# Altium schematic sheet WF_AutoCar.SchDoc
size A2
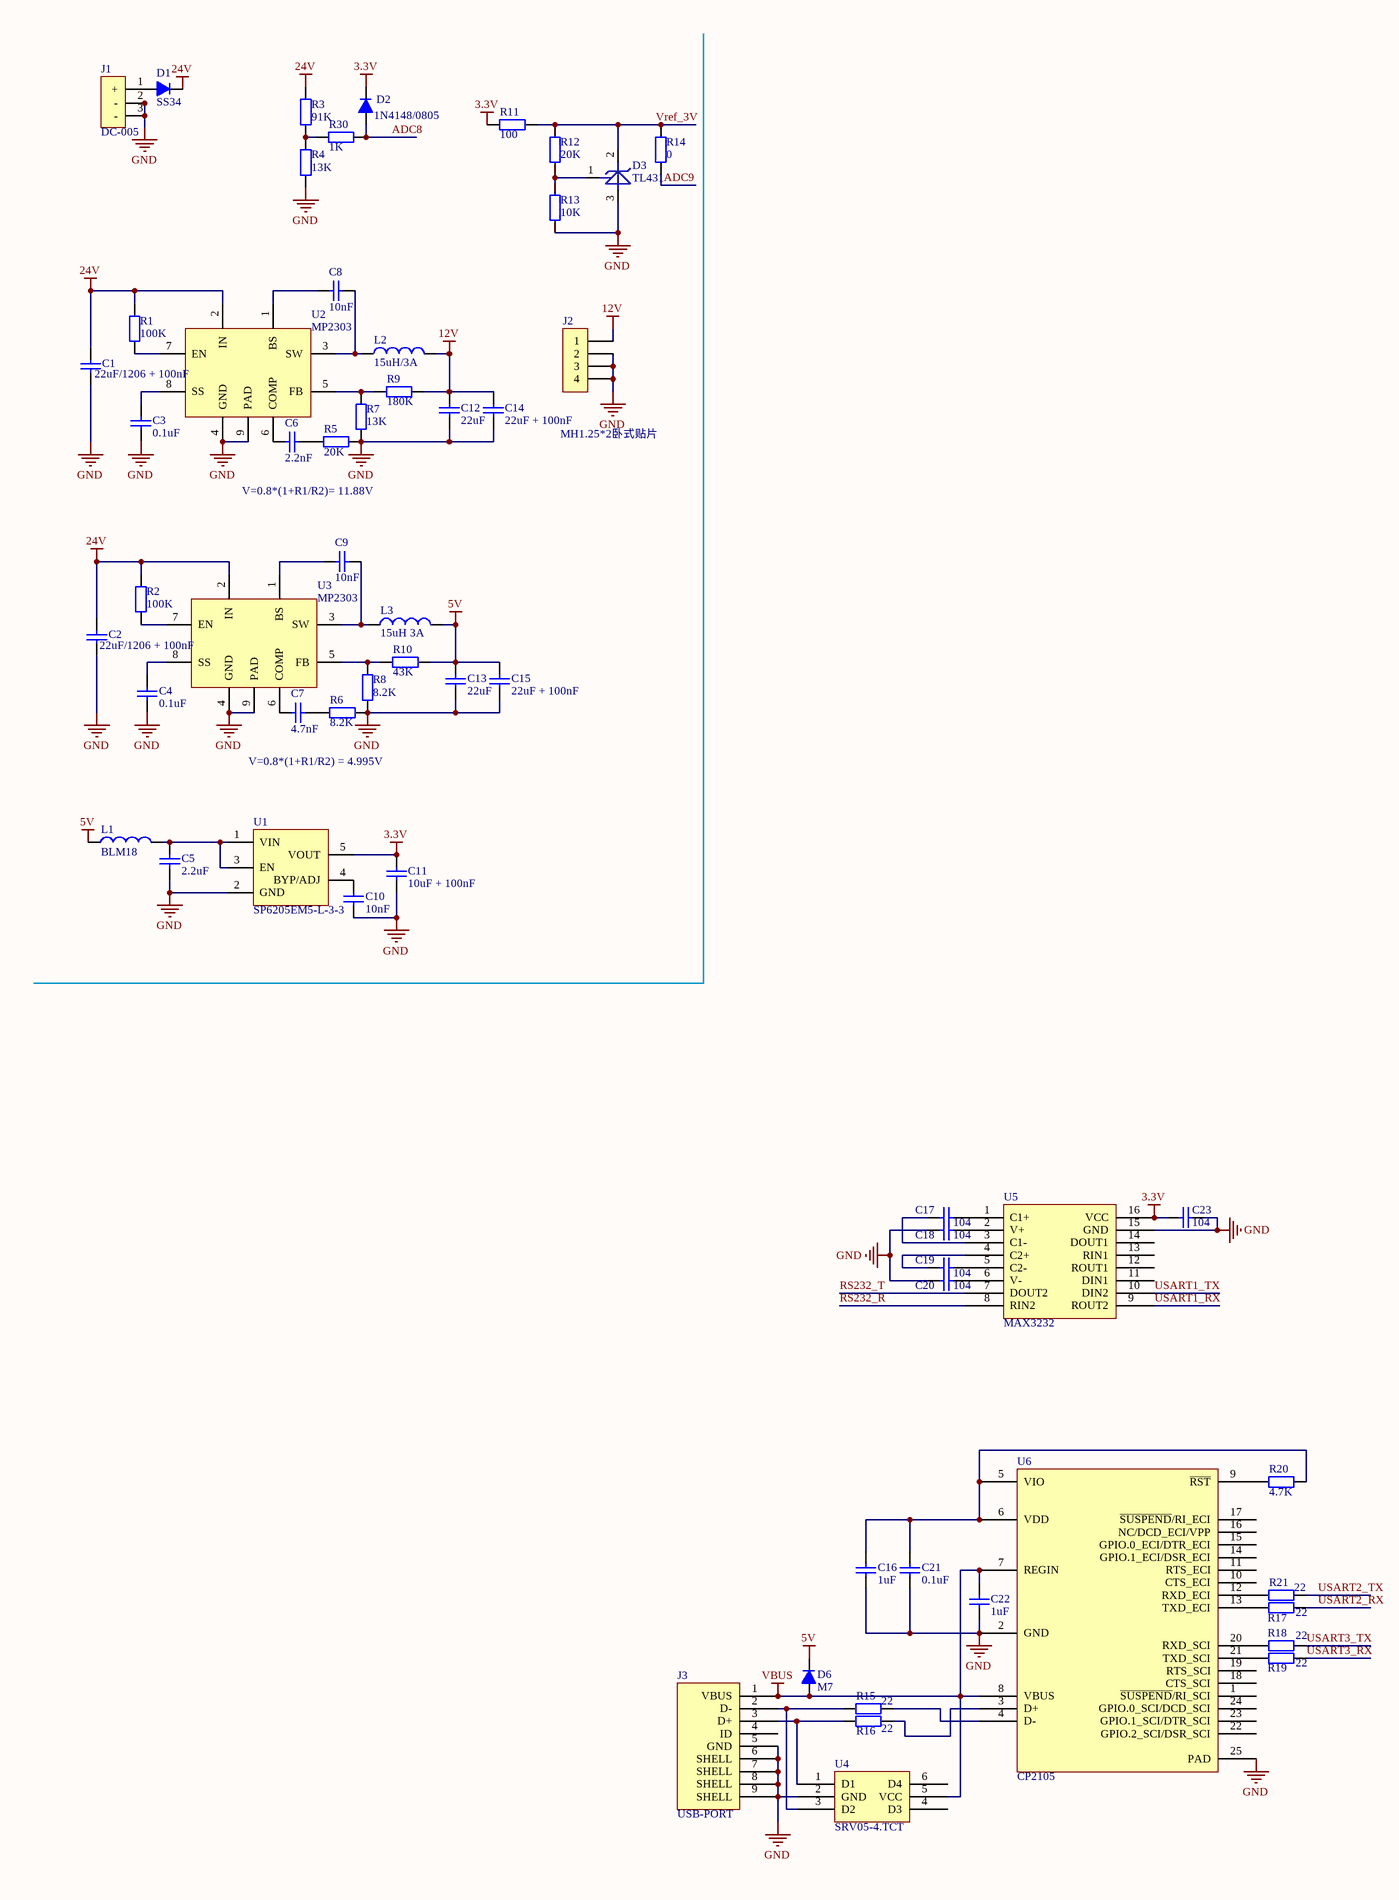
[diagram p0: WF_AutoCar.SchDoc, left]
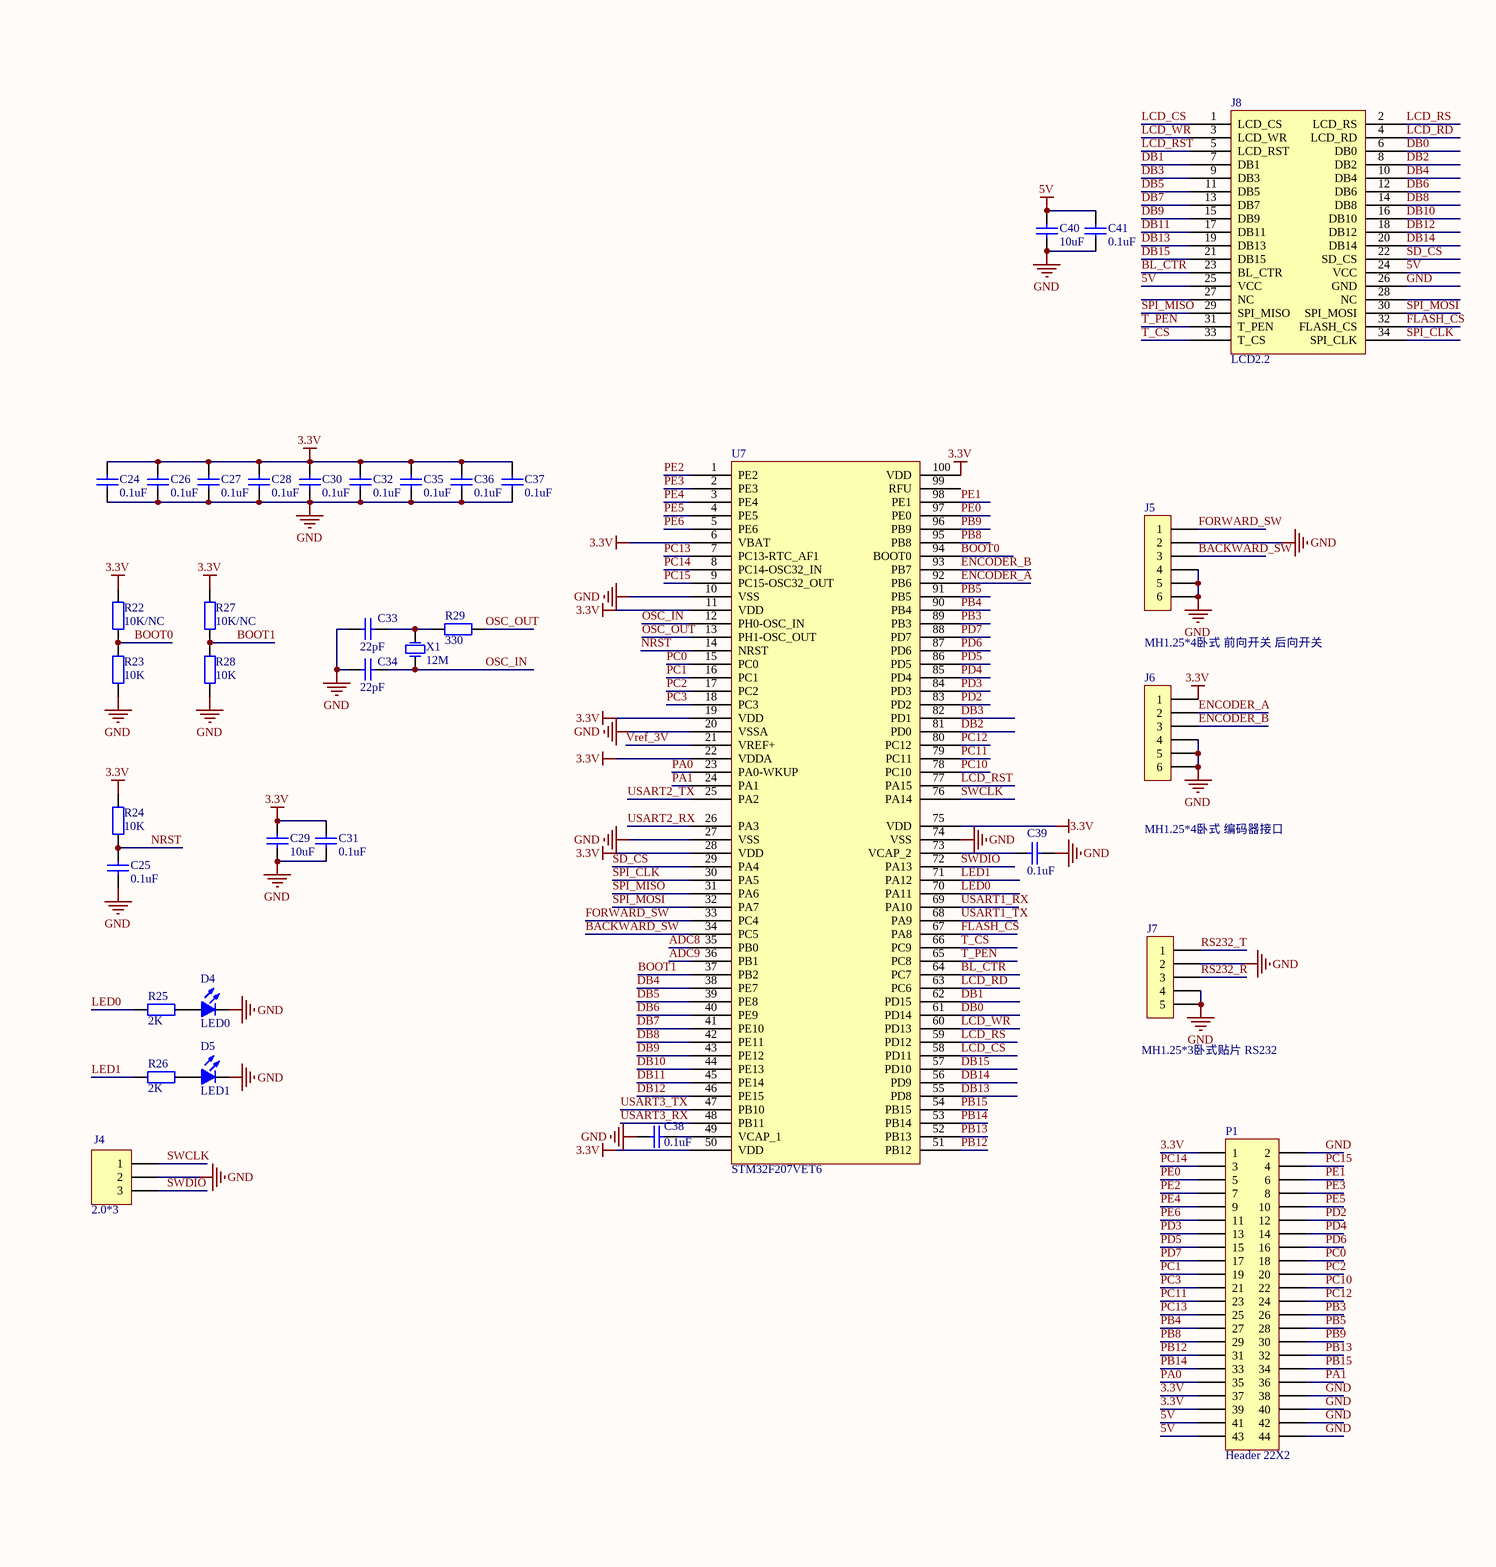
[diagram p1: WF_AutoCar.SchDoc, right]

## Parts
C1  value 22uF/1206 + 100nF  [C1206]  (hidden comment: Cap1)
C2  value 22uF/1206 + 100nF  [C1206]  (hidden comment: Cap1)
C3  value 0.1uF  [C0402]  (hidden comment: Cap1)
C4  value 0.1uF  [C0402]  (hidden comment: Cap1)
C5  value 2.2uF  [CC0805]  (hidden comment: Cap1)
C6  value 2.2nF  [C0402]  (hidden comment: Cap1)
C7  value 4.7nF  [C0402]  (hidden comment: Cap1)
C8  value 10nF  [C0402]  (hidden comment: Cap1)
C9  value 10nF  [C0402]  (hidden comment: Cap1)
C10  value 10nF  [C0402]  (hidden comment: Cap1)
C11  value 10uF + 100nF  [CC0805]  (hidden comment: Cap1)
C12  value 22uF  [CC0805]  (hidden comment: Cap1)
C13  value 22uF  [CC0805]  (hidden comment: Cap1)
C14  value 22uF + 100nF  [CC0805]  (hidden comment: Cap1)
C15  value 22uF + 100nF  [CC0805]  (hidden comment: Cap1)
C16  value 1uF  [C0402]  (hidden comment: Cap1)
C17  value 104  [C0402]  (hidden comment: Cap1)
C18  value 104  [C0402]  (hidden comment: Cap1)
C19  value 104  [C0402]  (hidden comment: Cap1)
C20  value 104  [C0402]  (hidden comment: Cap1)
C21  value 0.1uF  [C0402]  (hidden comment: Cap1)
C22  value 1uF  [C0402]  (hidden comment: Cap1)
C23  value 104  [C0402]  (hidden comment: Cap1)
C24  value 0.1uF  [C0402]  (hidden comment: Cap1)
C25  value 0.1uF  [C0402]  (hidden comment: Cap1)
C26  value 0.1uF  [C0402]  (hidden comment: Cap1)
C27  value 0.1uF  [C0402]  (hidden comment: Cap1)
C28  value 0.1uF  [C0402]  (hidden comment: Cap1)
C29  value 10uF  [CC0805]  (hidden comment: Cap1)
C30  value 0.1uF  [C0402]  (hidden comment: Cap1)
C31  value 0.1uF  [C0402]  (hidden comment: Cap1)
C32  value 0.1uF  [C0402]  (hidden comment: Cap1)
C33  value 22pF  [C0402]  (hidden comment: Cap1)
C34  value 22pF  [C0402]  (hidden comment: Cap1)
C35  value 0.1uF  [C0402]  (hidden comment: Cap1)
C36  value 0.1uF  [C0402]  (hidden comment: Cap1)
C37  value 0.1uF  [C0402]  (hidden comment: Cap1)
C38  value 0.1uF  [C0402]  (hidden comment: Cap1)
C39  value 0.1uF  [C0402]  (hidden comment: Cap1)
C40  value 10uF  [CC0805]  (hidden comment: Cap1)
C41  value 0.1uF  [C0402]  (hidden comment: Cap1)
D1  SS34  [LC-SMA(DO-214AC)_S2]
D2  1N4148/0805  [Diode-0805]
D3  TL431  [SOT-23]
D4  LED0  [DIODE-12]
D5  LED1  [DIODE-12]
D6  M7  [LC-SMA(DO-214AC)_S2]
J1  DC-005  [DC10B]
J2  MH1.25*2卧式贴片  [MH1.25*2立式表贴]
J3  USB-PORT  [USB/SM0.8-6H5]
J4  2.0*3  [Con3_2.0]
J5  MH1.25*4卧式 前向开关 后向开关  [MH1.25*4立式表贴]
J6  MH1.25*4卧式 编码器接口  [MH1.25*4立式表贴]
J7  MH1.25*3卧式贴片 RS232  [MH1.25*3立式表贴]
J8  LCD2.2  [2.2TFT_ILI9325]
L1  BLM18  [CC0805]
L2  value 15uH/3A  [0630]  (hidden comment: Inductor)
L3  value 15uH 3A  [0630]  (hidden comment: Inductor)
P1  Header 22X2  [HDR2X22]
R1  value 100K  [C0402]  (hidden comment: Res1)
R2  value 100K  [C0402]  (hidden comment: Res1)
R3  value 91K  [C0402]  (hidden comment: Res1)
R4  value 13K  [C0402]  (hidden comment: Res1)
R5  value 20K  [C0402]  (hidden comment: Res1)
R6  value 8.2K  [C0402]  (hidden comment: Res1)
R7  value 13K  [C0402]  (hidden comment: Res1)
R8  value 8.2K  [C0402]  (hidden comment: Res1)
R9  value 180K  [C0402]  (hidden comment: Res1)
R10  value 43K  [C0402]  (hidden comment: Res1)
R11  value 100  [C0402]  (hidden comment: Res1)
R12  value 20K  [C0402]  (hidden comment: Res1)
R13  value 10K  [C0402]  (hidden comment: Res1)
R14  value 0  [C0402]  (hidden comment: Res1)
R15  value 22  [C0402]  (hidden comment: Res1)
R16  value 22  [C0402]  (hidden comment: Res1)
R17  value 22  [C0402]  (hidden comment: Res1)
R18  value 22  [C0402]  (hidden comment: Res1)
R19  value 22  [C0402]  (hidden comment: Res1)
R20  value 4.7K  [C0402]  (hidden comment: Res1)
R21  value 22  [C0402]  (hidden comment: Res1)
R22  value 10K/NC  [C0402]  (hidden comment: Res1)
R23  value 10K  [C0402]  (hidden comment: Res1)
R24  value 10K  [C0402]  (hidden comment: Res1)
R25  value 2K  [C0402]  (hidden comment: Res1)
R26  value 2K  [C0402]  (hidden comment: Res1)
R27  value 10K/NC  [C0402]  (hidden comment: Res1)
R28  value 10K  [C0402]  (hidden comment: Res1)
R29  value 330  [C0402]  (hidden comment: Res1)
R30  value 1K  [C0402]  (hidden comment: Res1)
U1  SP6205EM5-L-3-3  [LC-SOT-23-5]
U2  MP2303  [LC-SOIC-8_150mil]
U3  MP2303  [LC-SOIC-8_150mil]
U4  SRV05-4.TCT  [LC-SOT-23-6]
U5  MAX3232  [SOP16M]
U6  CP2105  [QFN-24]
U7  STM32F207VET6  [LC-LQFP-100_14x14x05P]
X1  12M  [XTAL-3225]

## Nets
3.3V: C11.2 C23.1 C24.2 C26.2 C27.2 C28.2 C29.2 C30.2 C31.2 C32.2 C35.2 C36.2 C37.2 D2.2(K) J6.1 P1.1 P1.37 P1.39 R11.2 R22.2 R24.1 R27.2 U1.5(VOUT) U5.16(VCC) U7.6(VBAT) U7.11(VDD) U7.19(VDD) U7.22(VDDA) U7.28(VDD) U7.50(VDD) U7.75(VDD) U7.100(VDD)
5V: C13.2 C15.2 C40.2 C41.2 D6.2(K) J8.24(VCC) J8.25(VCC) L1.1 L3.2 P1.41 P1.43 R10.2
12V: C12.2 C14.2 J2.1 L2.2 R9.2
24V: C1.2 C2.2 D1.2(K) R1.2 R2.2 R3.2 U2.2(IN) U3.2(IN)
GND: C1.1 C2.1 C3.1 C4.1 C5.1 C10.1 C11.1 C12.1 C13.1 C14.1 C15.1 C16.1 C18.1 C19.1 C21.1 C22.1 C23.2 C24.1 C25.1 C26.1 C27.1 C28.1 C29.1 C30.1 C31.1 C32.1 C33.2 C34.2 C35.1 C36.1 C37.1 C38.1 C39.2 C40.1 C41.1 D3.3 D4.2(K) D5.2(K) J1.2(-) J1.3(-) J2.2 J2.3 J2.4 J3.5(GND) J3.6(SHELL) J3.7(SHELL) J3.8(SHELL) J3.9(SHELL) J4.2 J5.2 J5.4 J5.5 J5.6 J6.4 J6.5 J6.6 J7.2 J7.4 J7.5 J8.26(GND) P1.2 P1.38 P1.40 P1.42 P1.44 R4.1 R5.2 R6.2 R7.1 R8.1 R13.2 R23.1 R28.1 U1.2(GND) U2.4(GND) U2.9(PAD) U3.4(GND) U3.9(PAD) U4.2(GND) U5.15(GND) U6.2(GND) U6.25(PAD) U7.10(VSS) U7.20(VSSA) U7.27(VSS) U7.74(VSS)
VBUS: C22.2 D6.1(A) J3.1(VBUS) U4.5(VCC) U6.7(REGIN) U6.8(VBUS)
ADC8: D2.1(A) R30.2 U7.35(PB0)
ADC9: R14.1 U7.36(PB1)
BACKWARD_SW: J5.3 U7.34(PC5)
BL_CTR: J8.23(BL_CTR) U7.64(PC7)
BOOT0: R22.1 R23.2 U7.94(BOOT0)
BOOT1: R27.1 R28.2 U7.37(PB2)
DB0: J8.6(DB0) U7.61(PD14)
DB1: J8.7(DB1) U7.62(PD15)
DB2: J8.8(DB2) U7.81(PD0)
DB3: J8.9(DB3) U7.82(PD1)
DB4: J8.10(DB4) U7.38(PE7)
DB5: J8.11(DB5) U7.39(PE8)
DB6: J8.12(DB6) U7.40(PE9)
DB7: J8.13(DB7) U7.41(PE10)
DB8: J8.14(DB8) U7.42(PE11)
DB9: J8.15(DB9) U7.43(PE12)
DB10: J8.16(DB10) U7.44(PE13)
DB11: J8.17(DB11) U7.45(PE14)
DB12: J8.18(DB12) U7.46(PE15)
DB13: J8.19(DB13) U7.55(PD8)
DB14: J8.20(DB14) U7.56(PD9)
DB15: J8.21(DB15) U7.57(PD10)
ENCODER_A: J6.2 U7.92(PB6)
ENCODER_B: J6.3 U7.93(PB7)
FLASH_CS: J8.32(FLASH_CS) U7.67(PA8)
FORWARD_SW: J5.1 U7.33(PC4)
LCD_CS: J8.1(LCD_CS) U7.58(PD11)
LCD_RD: J8.4(LCD_RD) U7.63(PC6)
LCD_RS: J8.2(LCD_RS) U7.59(PD12)
LCD_RST: J8.5(LCD_RST) U7.77(PA15)
LCD_WR: J8.3(LCD_WR) U7.60(PD13)
LED0: R25.1 U7.70(PA11)
LED1: R26.1 U7.71(PA12)
NRST: C25.2 R24.2 U7.14(NRST)
OSC_IN: C34.1 U7.12(PH0-OSC_IN) X1.2(OSC2)
OSC_OUT: R29.1 U7.13(PH1-OSC_OUT)
PA0: P1.35 U7.23(PA0-WKUP)
PA1: P1.36 U7.24(PA1)
PB3: P1.26 U7.89(PB3)
PB4: P1.27 U7.90(PB4)
PB5: P1.28 U7.91(PB5)
PB8: P1.29 U7.95(PB8)
PB9: P1.30 U7.96(PB9)
PB12: P1.31 U7.51(PB12)
PB13: P1.32 U7.52(PB13)
PB14: P1.33 U7.53(PB14)
PB15: P1.34 U7.54(PB15)
PC0: P1.18 U7.15(PC0)
PC1: P1.19 U7.16(PC1)
PC2: P1.20 U7.17(PC2)
PC3: P1.21 U7.18(PC3)
PC10: P1.22 U7.78(PC10)
PC11: P1.23 U7.79(PC11)
PC12: P1.24 U7.80(PC12)
PC13: P1.25 U7.7(PC13-RTC_AF1)
PC14: P1.3 U7.8(PC14-OSC32_IN)
PC15: P1.4 U7.9(PC15-OSC32_OUT)
PD2: P1.12 U7.83(PD2)
PD3: P1.13 U7.84(PD3)
PD4: P1.14 U7.85(PD4)
PD5: P1.15 U7.86(PD5)
PD6: P1.16 U7.87(PD6)
PD7: P1.17 U7.88(PD7)
PE0: P1.5 U7.97(PE0)
PE1: P1.6 U7.98(PE1)
PE2: P1.7 U7.1(PE2)
PE3: P1.8 U7.2(PE3)
PE4: P1.9 U7.3(PE4)
PE5: P1.10 U7.4(PE5)
PE6: P1.11 U7.5(PE6)
RS232_R: J7.3 U5.8(RIN2)
RS232_T: J7.1 U5.7(DOUT2)
SD_CS: J8.22(SD_CS) U7.29(PA4)
SPI_CLK: J8.34(SPI_CLK) U7.30(PA5)
SPI_MISO: J8.29(SPI_MISO) U7.31(PA6)
SPI_MOSI: J8.30(SPI_MOSI) U7.32(PA7)
SWCLK: J4.1 U7.76(PA14)
SWDIO: J4.3 U7.72(PA13)
T_CS: J8.33(T_CS) U7.66(PC9)
T_PEN: J8.31(T_PEN) U7.65(PC8)
USART1_RX: U5.9(ROUT2) U7.69(PA10)
USART1_TX: U5.10(DIN2) U7.68(PA9)
USART2_RX: R17.2 U7.26(PA3)
USART2_TX: R21.2 U7.25(PA2)
USART3_RX: R19.2 U7.48(PB11)
USART3_TX: R18.2 U7.47(PB10)
Vref_3V: D3.2 R11.1 R12.1 R14.2 U7.21(VREF+)
NetC3_2: C3.2 U2.8(SS)
NetC4_2: C4.2 U3.8(SS)
NetC5_2: C5.2 L1.2 U1.1(VIN) U1.3(EN)
NetC6_1: C6.1 R5.1
NetC6_2: C6.2 U2.6(COMP)
NetC7_1: C7.1 R6.1
NetC7_2: C7.2 U3.6(COMP)
NetC8_1: C8.1 U2.1(BS)
NetC8_2: C8.2 L2.1 U2.3(SW)
NetC9_1: C9.1 U3.1(BS)
NetC9_2: C9.2 L3.1 U3.3(SW)
NetC10_2: C10.2 U1.4(BYP/ADJ)
NetC16_2: C16.2 C21.2 R20.2 U6.5(VIO) U6.6(VDD)
NetC17_1: C17.1 U5.1(C1+)
NetC17_2: C17.2 U5.3(C1-)
NetC18_2: C18.2 U5.2(V+)
NetC19_2: C19.2 U5.6(V-)
NetC20_1: C20.1 U5.4(C2+)
NetC20_2: C20.2 U5.5(C2-)
NetC33_1: C33.1 R29.2 X1.1(OSC1)
NetC38_2: C38.2 U7.49(VCAP_1)
NetC39_1: C39.1 U7.73(VCAP_2)
NetD1_1: D1.1(A) J1.1(+)
NetD3_1: D3.1 R12.2 R13.1
NetD4_1: D4.1(A) R25.2
NetD5_1: D5.1(A) R26.2
NetJ3_2: J3.2(D-) R15.1 U4.3(D2)
NetJ3_3: J3.3(D+) R16.1 U4.1(D1)
NetR1_1: R1.1 U2.7(EN)
NetR2_1: R2.1 U3.7(EN)
NetR3_1: R3.1 R4.2 R30.1
NetR7_2: R7.2 R9.1 U2.5(FB)
NetR8_2: R8.2 R10.1 U3.5(FB)
NetR15_2: R15.2 U6.4(D-)
NetR16_2: R16.2 U6.3(D+)
NetR17_1: R17.1 U6.13(TXD_ECI)
NetR18_1: R18.1 U6.20(RXD_SCI)
NetR19_1: R19.1 U6.21(TXD_SCI)
NetR20_1: R20.1 U6.9(~{RST})
NetR21_1: R21.1 U6.12(RXD_ECI)

Not connected (* = marked no-connect by the designer): J3 4(ID); J8 27(NC) 28(NC); U4 4(D3) 6(D4); U5 11(DIN1) 12(ROUT1) 13(RIN1) 14(DOUT1); U6 1(~{SUSPEND}/RI_SCI) 10(CTS_ECI) 11(RTS_ECI) 14(GPIO.1_ECI/DSR_ECI) 15(GPIO.0_ECI/DTR_ECI) 16(NC/DCD_ECI/VPP) 17(~{SUSPEND}/RI_ECI) 18(CTS_SCI) 19(RTS_SCI) 22(GPIO.2_SCI/DSR_SCI) 23(GPIO.1_SCI/DTR_SCI) 24(GPIO.0_SCI/DCD_SCI); U7 99(RFU)

## Notes on the sheet
- V=0.8*(1+R1/R2)= 11.88V
- V=0.8*(1+R1/R2) = 4.995V

## Library data of the parts
C1-C41 = Cap1: Capacitor; Published: 8-Jun-2000; LatestRevisionDate: 17-Jul-2002; LatestRevisionNote: Re-released for DXP Platform.; PackageReference: RAD-0.3; Publisher: Altium Limited
D1 D2 D6 = Diode1
D3 = TL431-SOT23
D4 D5 = LED1: Typical INFRARED GaAs LED; Published: 8-Jun-2000; LatestRevisionDate: 08-Jul-2005; LatestRevisionNote: Mech Layer 1 removed.; PackageReference: LED-0; Publisher: Altium Limited
J4 = Con3_2.0: Header, 3-Pin; LatestRevisionDate: 17-Jul-2002; LatestRevisionNote: Re-released for DXP Platform.; Publisher: Altium Limited
J5 J6 = MH1.25*4立式贴片
J7 = MH1.25*3卧式贴片
J8 = 2.2 LCD ILI9325
L2 L3 = Inductor: Code_IEC: 1005; Published: 8-Jun-2000; LatestRevisionDate: 17-Jul-2002; LatestRevisionNote: Re-released for DXP Platform.; PackageReference: 0402-A; Publisher: Altium Limited; Code_JEITA: 0402
P1 = Header 22X2: Header, 22-Pin, Dual row; LatestRevisionDate: 17-Jul-2002; LatestRevisionNote: Re-released for DXP Platform.; Publisher: Altium Limited
R1-R30 = Res1: Resistor; Published: 8-Jun-2000; LatestRevisionDate: 17-Jul-2002; LatestRevisionNote: Re-released for DXP Platform.; PackageReference: AXIAL-0.4; Publisher: Altium Limited
U2 U3 = MP2307
X1 = XTAL_1: Crystal Oscillator; Published: 8-Jun-2000; LatestRevisionDate: 17-Jul-2002; LatestRevisionNote: Re-released for DXP Platform.; PackageReference: R38; Publisher: Altium Limited